# Altium schematic sheet receiver_car_2s.SchDoc
size A3
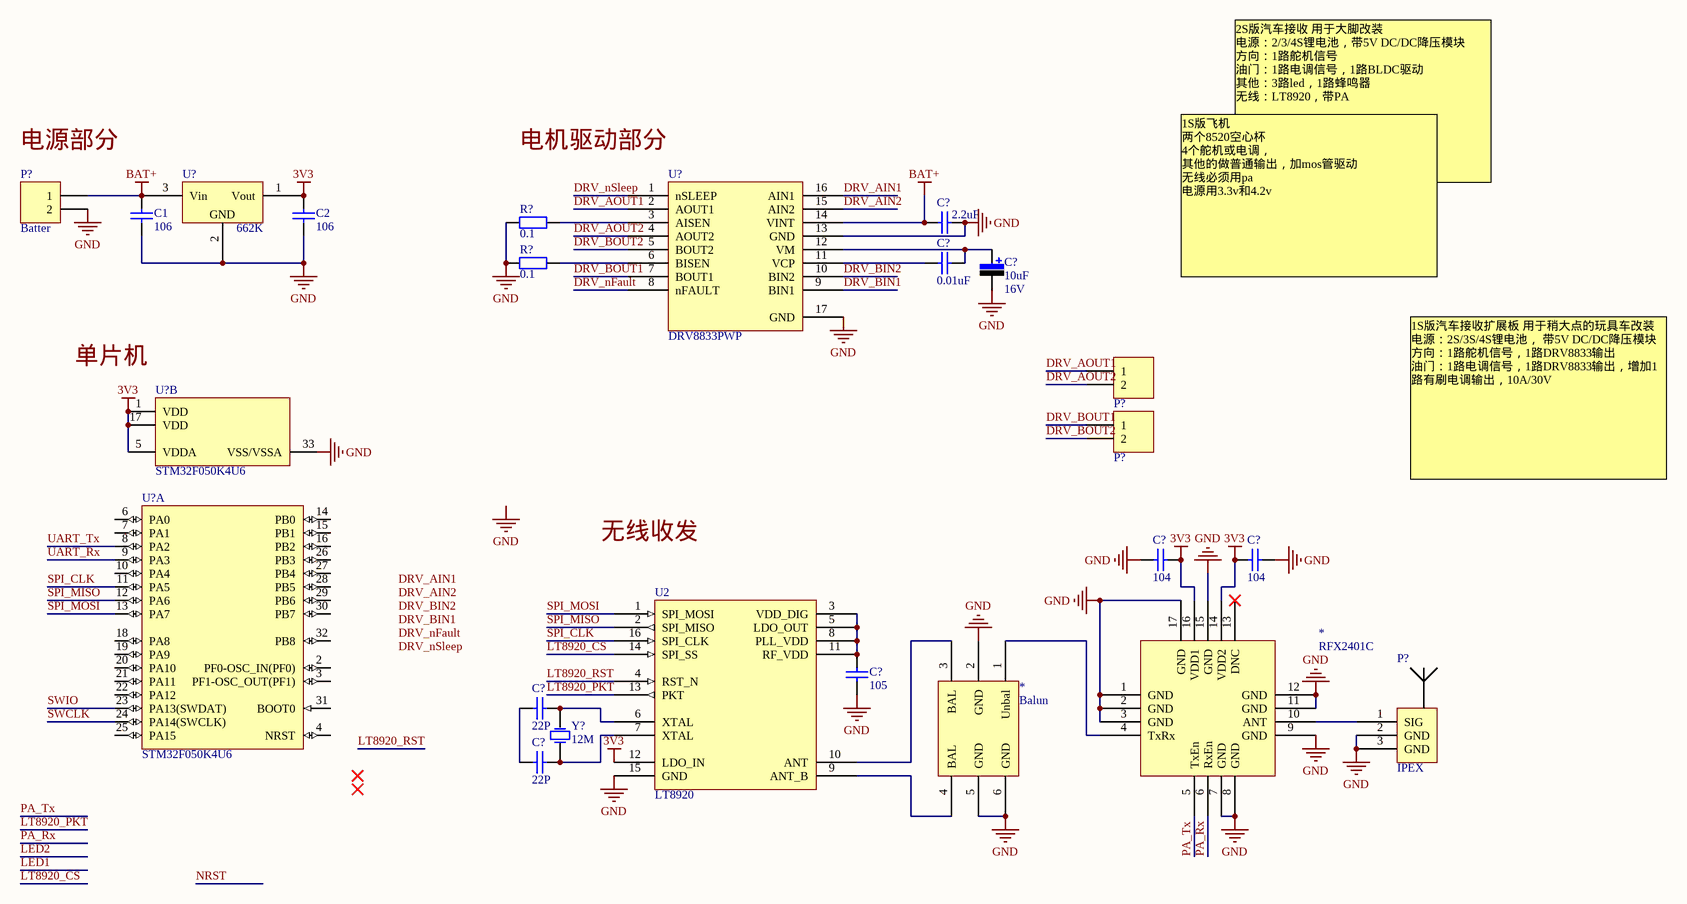
[diagram p0: receiver_car_2s.SchDoc]

## Parts
(Parts that share a designator on the sheet are numbered #1, #2 ... from top to bottom, then left to right.)
*#1  RFX2401C  [QFN-16 - duplicate]
*#2  Balun  [Balun]
C1  106  [0805]
C2  106  [0805]
C?#1  value 2.2uF  [0805-2]  (hidden comment: Cap)
C?#2  value 0.01uF  [0805-2]  (hidden comment: Cap)
C?#3  value 10uF  Vol: 16V  [C-RB-8]  (hidden comment: Cap Pol)
C?#4  value 104  [0805-2]  (hidden comment: Cap)
C?#5  value 104  [0805-2]  (hidden comment: Cap)
C?#6  value 105  [0805-2]  (hidden comment: Cap)
C?#7  value 22P  [0805-2]  (hidden comment: Cap)
C?#8  value 22P  [0805-2]  (hidden comment: Cap)
P?#1  Batter  [HDR1X2]
P?#2  Header 2  [HDR2X1_A]  (value not drawn)
P?#3  Header 2  [HDR2X1_A]  (value not drawn)
P?#4  IPEX  [U.FL-R-SMT]
R?#1  value 0.1  [0603-1]  (hidden comment: Res1)
R?#2  value 0.1  [0603-1]  (hidden comment: Res1)
U2  LT8920
U?#1  DRV8833PWP  [HTSSOP-16 DRV8833]
U?#2  662K  [SOT-23]
U?#3  STM32F050K4U6  [STM-UFQFPN32_N]  (part B of 2)
U?#4  STM32F050K4U6  [STM-UFQFPN32_N]  (part A of 2)
Y?  value 12M  [X-HC49U]  (hidden comment: XTAL)

## Nets
3V3: *#1.14(VDD2) *#1.16(VDD1) C2.2 C?#4.1 C?#5.2 U2.12(LDO_IN) U?#2.1(Vout) U?#3.1(VDD) U?#3.5(VDDA) U?#3.17(VDD)
BAT+: C1.2 C?#1.2 P?#1.1 U?#1.14(VINT) U?#2.3(Vin)
GND: *#1.1(GND) *#1.2(GND) *#1.3(GND) *#1.7(GND) *#1.8(GND) *#1.9(GND) *#1.11(GND) *#1.12(GND) *#1.15(GND) *#1.17(GND) *#2.2(GND) *#2.5(GND) *#2.6(GND) C1.1 C2.1 C?#1.1 C?#3.2 C?#4.2 C?#5.1 C?#6.1 P?#1.2 P?#4.2(GND) P?#4.3(GND) R?#1.2 R?#2.2 U2.15(GND) U?#1.13(GND) U?#1.17(GND) U?#2.2(Vss) U?#3.33(VSS/VSSA)
DRV_AIN1: U?#1.16(AIN1)
DRV_AIN2: U?#1.15(AIN2)
DRV_AOUT1: P?#2.1 U?#1.2(AOUT1)
DRV_AOUT2: P?#2.2 U?#1.4(AOUT2)
DRV_BIN1: U?#1.9(BIN1)
DRV_BIN2: U?#1.10(BIN2)
DRV_BOUT1: P?#3.1 U?#1.7(BOUT1)
DRV_BOUT2: P?#3.2 U?#1.5(BOUT2)
DRV_nFault: U?#1.8(nFAULT)
DRV_nSleep: U?#1.1(nSLEEP)
LT8920_CS: U2.14(SPI_SS)
LT8920_PKT: U2.13(PKT)
LT8920_RST: U2.4(RST_N)
PA_Rx: *#1.6(RxEn)
PA_Tx: *#1.5(TxEn)
SPI_CLK: U2.16(SPI_CLK) U?#4.11(PA5)
SPI_MISO: U2.2(SPI_MISO) U?#4.12(PA6)
SPI_MOSI: U2.1(SPI_MOSI) U?#4.13(PA7)
SWCLK: U?#4.24(PA14(SWCLK))
SWIO: U?#4.23(PA13(SWDAT))
UART_Rx: U?#4.9(PA3)
UART_Tx: U?#4.8(PA2)
Net*#1_4: *#1.4(TxRx) *#2.1(Unbal)
Net*#1_10: *#1.10(ANT) P?#4.1(SIG)
Net*#2_3: *#2.3(BAL) U2.10(ANT)
Net*#2_4: *#2.4(BAL) U2.9(ANT_B)
NetC?#2_1: C?#2.1 C?#3.1 U?#1.12(VM)
NetC?#2_2: C?#2.2 U?#1.11(VCP)
NetC?#6_2: C?#6.2 U2.3(VDD_DIG) U2.5(LDO_OUT) U2.8(PLL_VDD) U2.11(RF_VDD)
NetC?#7_1: C?#7.1 C?#8.1
NetC?#7_2: C?#7.2 U2.6(XTAL) Y?.2(OSC2)
NetC?#8_2: C?#8.2 U2.7(XTAL) Y?.1(OSC1)
NetR?#1_1: R?#1.1 U?#1.3(AISEN)
NetR?#2_1: R?#2.1 U?#1.6(BISEN)

Not connected (* = marked no-connect by the designer): *#1 13(DNC)*; U?#4 2(PF0-OSC_IN(PF0)) 3(PF1-OSC_OUT(PF1)) 4(NRST) 6(PA0) 7(PA1) 10(PA4) 14(PB0) 15(PB1) 16(PB2) 18(PA8) 19(PA9) 20(PA10) 21(PA11) 22(PA12) 25(PA15) 26(PB3) 27(PB4) 28(PB5) 29(PB6) 30(PB7) 31(BOOT0) 32(PB8)

## Notes on the sheet
- (near P?#1) 电源部分
- 电机驱动部分
- 2S版汽车接收 用于大脚改装
  电源：2/3/4S锂电池，带5V DC/DC降压模块
  方向：1路舵机信号
  油门：1路电调信号，1路BLDC驱动
  其他：3路led，1路蜂鸣器
  无线：LT8920，带PA
- 1S版飞机
  两个8520空心杯
  4个舵机或电调，
  其他的做普通输出，加mos管驱动
  无线必须用pa
  电源用3.3v和4.2v
- 单片机
- 1S版汽车接收扩展板 用于稍大点的玩具车改装
  电源：2S/3S/4S锂电池， 带5V DC/DC降压模块
  方向：1路舵机信号，1路DRV8833输出
  油门：1路电调信号，1路DRV8833输出，增加1路有刷电调输出，10A/30V
- 无线收发
- Labels drawn without touching a wire or pin: DRV_AIN1, DRV_AIN2, DRV_BIN1, DRV_BIN2, DRV_nFault, DRV_nSleep, GND
- (in symbol 662K) GND

## Library data of the parts
*#2 = Balun: 2450BM15A0002
C1 C2 = Cap Semi: Capacitor (Semiconductor SIM Model); Published: 8-Jun-2000; LatestRevisionDate: 29-May-2009; LatestRevisionNote: IPC-7351 Footprint Added.; PackageReference: C1206; Publisher: Altium Limited; PackageDescription: Chip Capacitor; Value: 106
C?#1 C?#2 C?#4-C?#8 = Cap: 无极性电容; Published: 8-Jun-2000; LatestRevisionDate: 17-Jul-2002; LatestRevisionNote: Re-released for DXP Platform.; PackageReference: RAD-0.3; Publisher: Altium Limited
C?#3 = Cap Pol: 极性电解电容; Published: 8-Jun-2000; LatestRevisionDate: 17-Jul-2002; LatestRevisionNote: Re-released for DXP Platform.; PackageReference: RB7.6-15; Publisher: Altium Limited
P?#1 = Header 2: Header, 2-Pin; LatestRevisionDate: 17-Jul-2002; LatestRevisionNote: Re-released for DXP Platform.; Publisher: Altium Limited
P?#2 P?#3 = Header 2: 接插件; LatestRevisionDate: 17-Jul-2002; LatestRevisionNote: Re-released for DXP Platform.; Publisher: Altium Limited
P?#4 = IPEX: U.FL-R-SMT
R?#1 R?#2 = Res1: 贴片电阻; Published: 8-Jun-2000; LatestRevisionDate: 17-Jul-2002; LatestRevisionNote: Re-released for DXP Platform.; PackageReference: AXIAL-0.4; Publisher: Altium Limited
U?#1 = DRV8833PWP: DRV8833_HTSSOP封装
U?#3 U?#4 = STM32F050K4U6: ARM Cortex-M0 32-bit MCU, 16 KB Flash, 4 KB Internal RAM, 27 I/Os, 32-pin UFQFPN, -40 to 85 degC, Tray; FLASH Size (Prog) (kB): 16; I/Os (High Current): 27; Internal RAM Size (kB): 4; Operating Frequency(F) (Processor speed) (MHz): 48; Supply Voltage(Vcc) min (V): 2; DatasheetVersion: Rev. 1; PackageVersion: Rev. 3, 07/2012; PackageReference: UFQFPN32; PackageDescription: 32-Pin Ultra Thin Fine Pitch Quad Flat No-Lead, 5 x 5 x 0.6 mm Body, 0.5 mm Pitch, Exposed Pad; Supplier 1: Digi-Key; Supplier Part Number 1: 497-13621-ND; Supplier 2: Farnell; Supplier Part Number 2: 2333139; Supplier 3: Newark; Supplier Part Number 3: 99W9752; Supplier 4: Newark; Supplier Part Number 4: 48W6864; Supplier 5: Mouser; Supplier Part Number 5: 511-STM32F050K4U6; Core: ARM Cortex-M0; Packing: Tray; Mounting Technology: Surface Mount; PartNumber: STM32F050K4U6; ComponentLink1Description: Manufacturer URL; ComponentLink1URL: http://www.st.com/web/en/home.html; ComponentLink2Description: Datasheet; ComponentLink2URL: http://www.st.com/st-web-ui/static/active/en/resource/technical/document/datasheet/DM00065136.pdf; ComponentLink3Description: Package Specification; ComponentLink3URL: http://www.st.com/st-web-ui/static/active/en/resource/technical/document/datasheet/DM00039193.pdf
Y? = XTAL: 晶振; Published: 8-Jun-2000; LatestRevisionDate: 17-Jul-2002; LatestRevisionNote: Re-released for DXP Platform.; PackageReference: R38; Publisher: Altium Limited